# Altium schematic sheet connectors.SchDoc
size A4
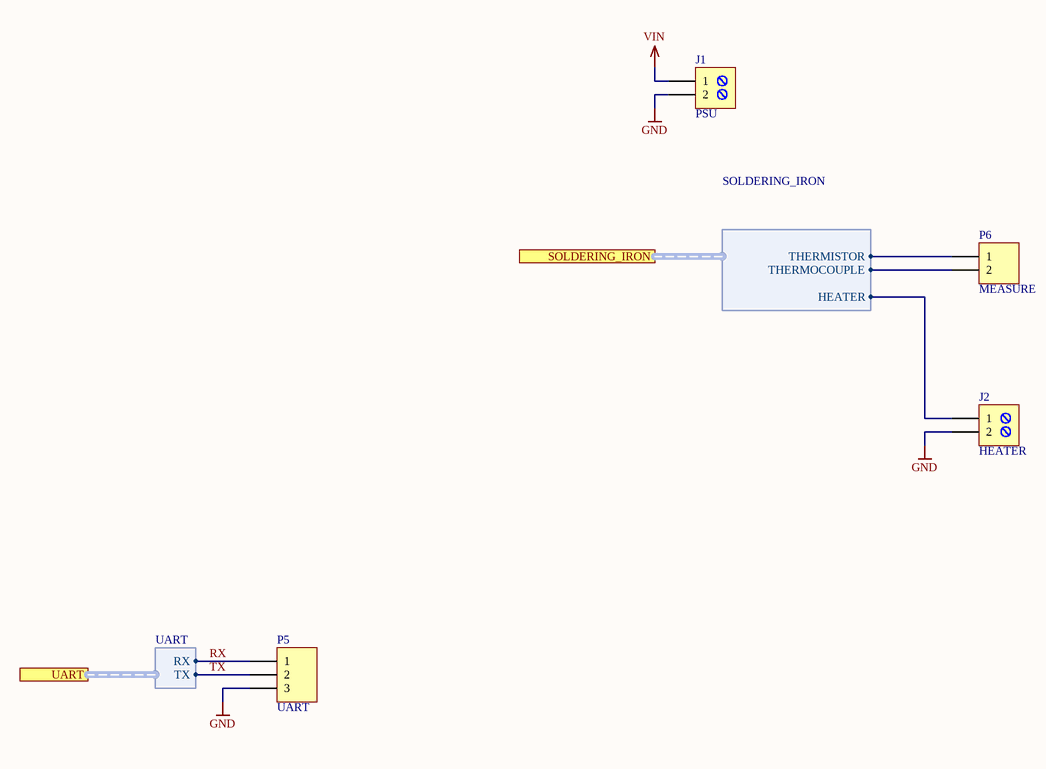
[diagram p0: connectors.SchDoc]

## Parts
J1  PSU  [J_ARK2]
J2  HEATER  [J_ARK2]
P5  UART  [P_HEADER_1x3_2.54]
P6  MEASURE  [P_HEADER_1x2_2.54]

## Ports
SOLDERING_IRON (harness SOLDERING_IRON), UART (harness UART)

## Harnesses
UART: RX, TX
SOLDERING_IRON: HEATER, THERMISTOR, THERMOCOUPLE

## Nets
GND: J1.2 J2.2 P5.3
VIN: J1.1
RX: P5.1 ; port UART.RX
TX: P5.2 ; port UART.TX
NetJ2_1: J2.1 ; port SOLDERING_IRON.HEATER
NetP6_1: P6.1 ; port SOLDERING_IRON.THERMISTOR
NetP6_2: P6.2 ; port SOLDERING_IRON.THERMOCOUPLE

## Library data of the parts
J1 J2 = J_TB-5.0-P-2P: ARK Screw terminal, 2-Pin; Manufacturer: DEGSON ELECTRONICS; Value: DG301-5.0-02P-12-18A(H); SCH_Footprint: ARK2; Part Number: J_TB-5.0-P-2P; Component Type: Standard; HelpURL: https://datasheet.octopart.com/DG301-5.0-03P-12-18A%28H%29-Degson-datasheet-17801202.pdf; Manufacturer Part Number: DG301-5.0-02P-12-18A(H); Supplier 1: TME; Supplier Part Number 1: DG301-5.0-2/6B; Supplier 2: RS Components; Supplier 3: Farnell; Supplier 4: Mouser; Supplier 5: Digi-Key
P5 = P_HEADER_1x3_2.54: Header, 3-Pin; Manufacturer: Connfly; Value: DS1021-1*3SF1-1; SCH_Footprint: 1x3 2.54mm; Part Number: P_HEADER_1x3_2.54; Component Type: Standard; HelpURL: http://www.tme.eu/en/Document/cc301e58a5da78cb543a94b5a5b7f06a/DS1021.pdf; Manufacturer Part Number: DS1021-1*3SF1-1; Supplier 1: TME; Supplier Part Number 1: ZL201-03G; Supplier 2: RS Components; Supplier 3: Farnell; Supplier 4: Mouser; Supplier 5: Digi-Key
P6 = P_HEADER_1x2_2.54: Header, 2-Pin; Manufacturer: Connfly; Value: DS1021-1*2SF1-1; SCH_Footprint: 1x2 2.54mm; Part Number: P_HEADER_1x2_2.54; Component Type: Standard; HelpURL: http://www.tme.eu/en/Document/cc301e58a5da78cb543a94b5a5b7f06a/DS1021.pdf; Manufacturer Part Number: DS1021-1*2SF1-1; Supplier 1: TME; Supplier Part Number 1: ZL201-02G; Supplier 2: RS Components; Supplier 3: Farnell; Supplier 4: Mouser; Supplier 5: Digi-Key